# EasyEDA Pro project ProPrj_Xen_2025-02-04.epro, board PCB1_3
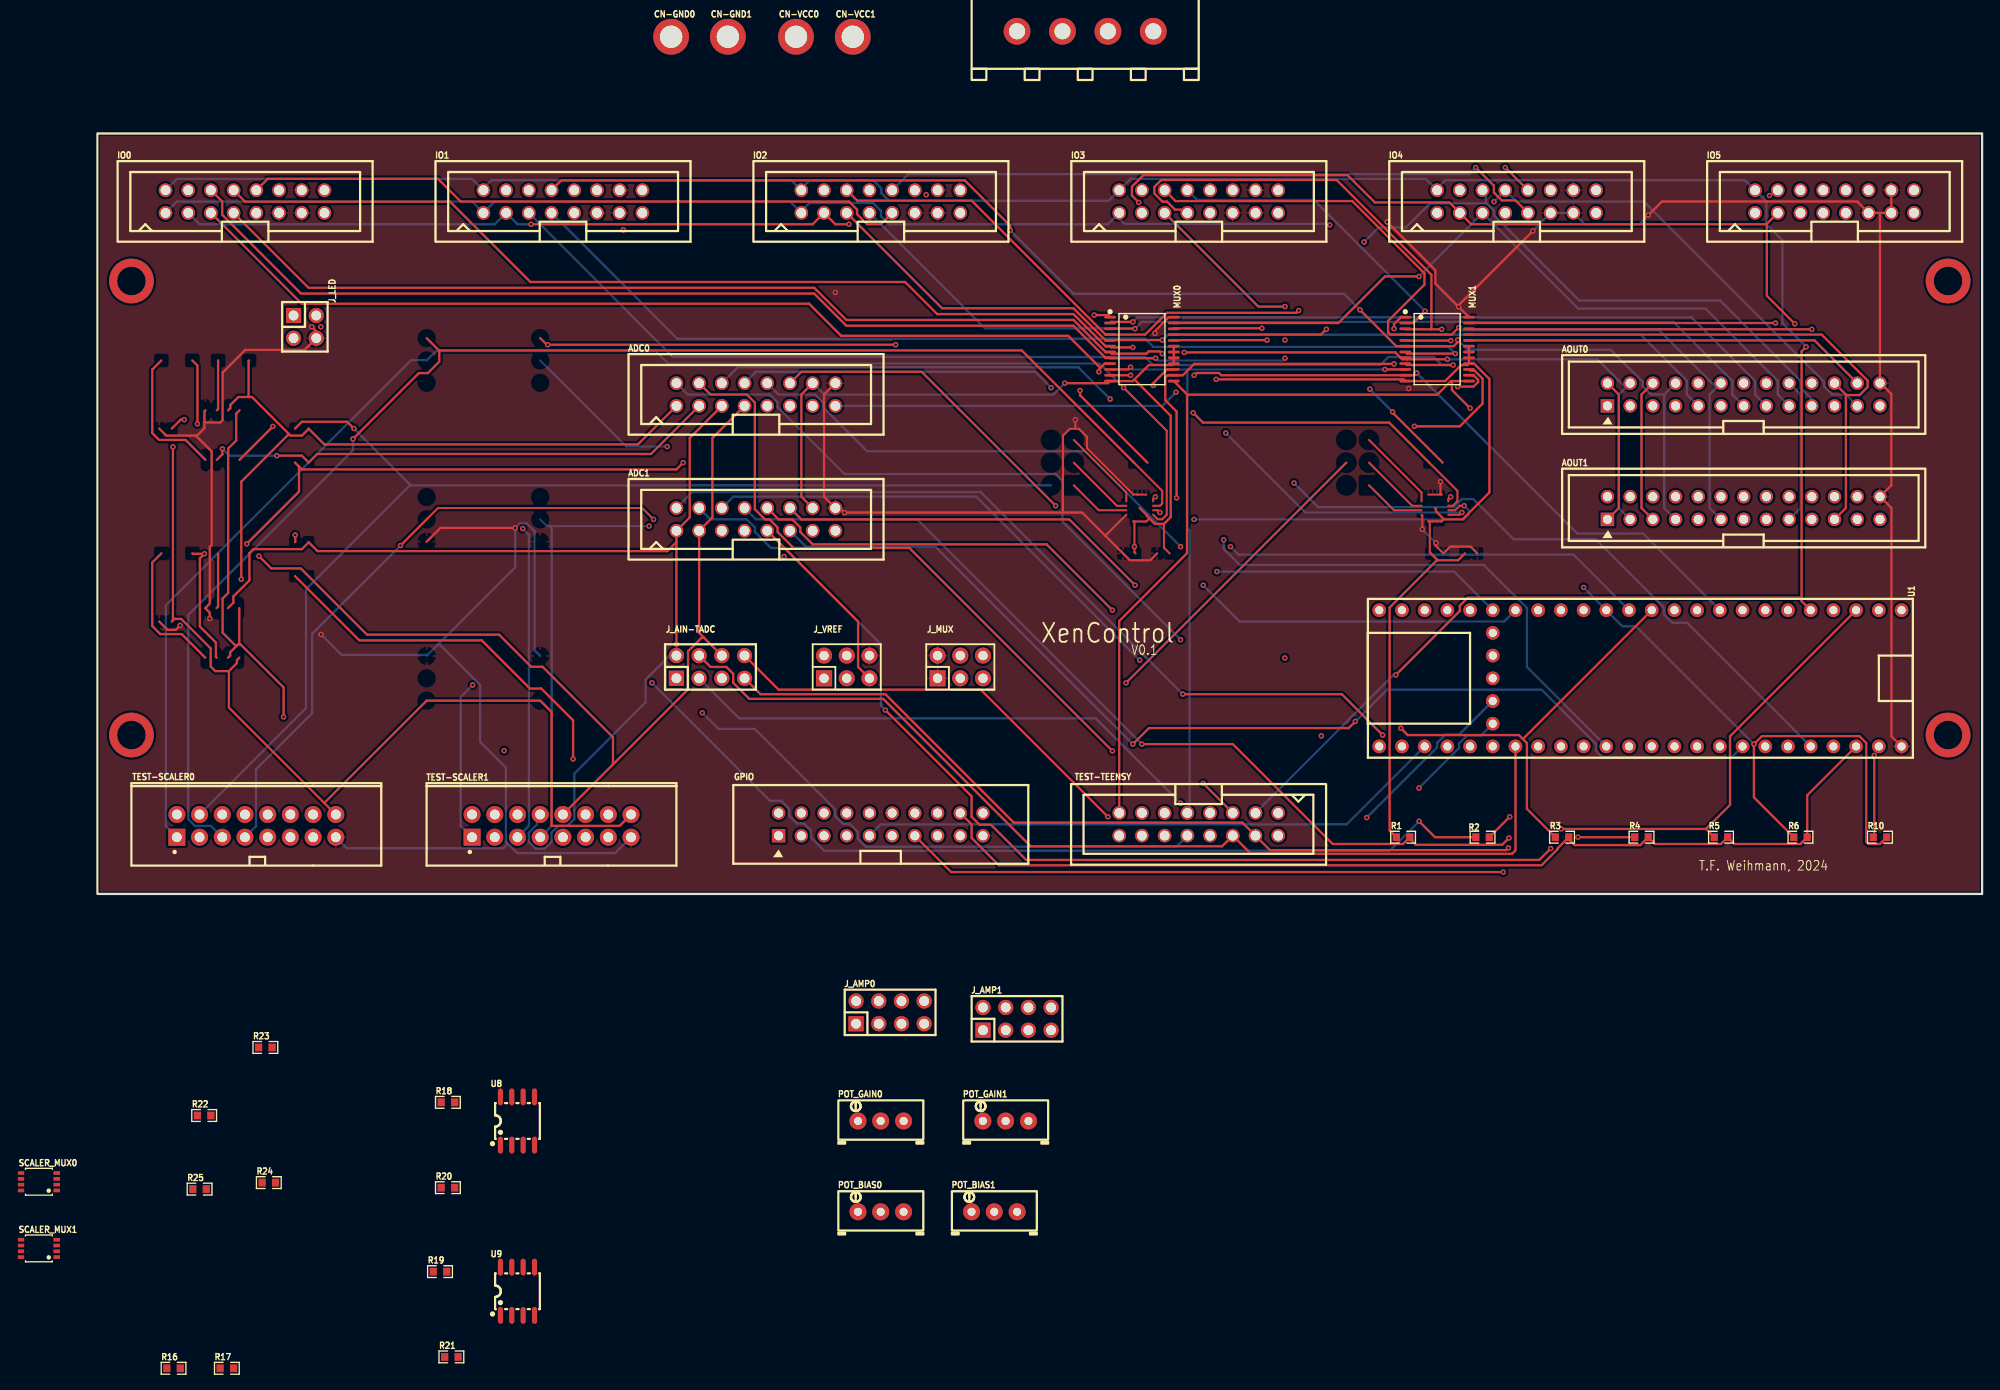
[diagram p28: board, top side]
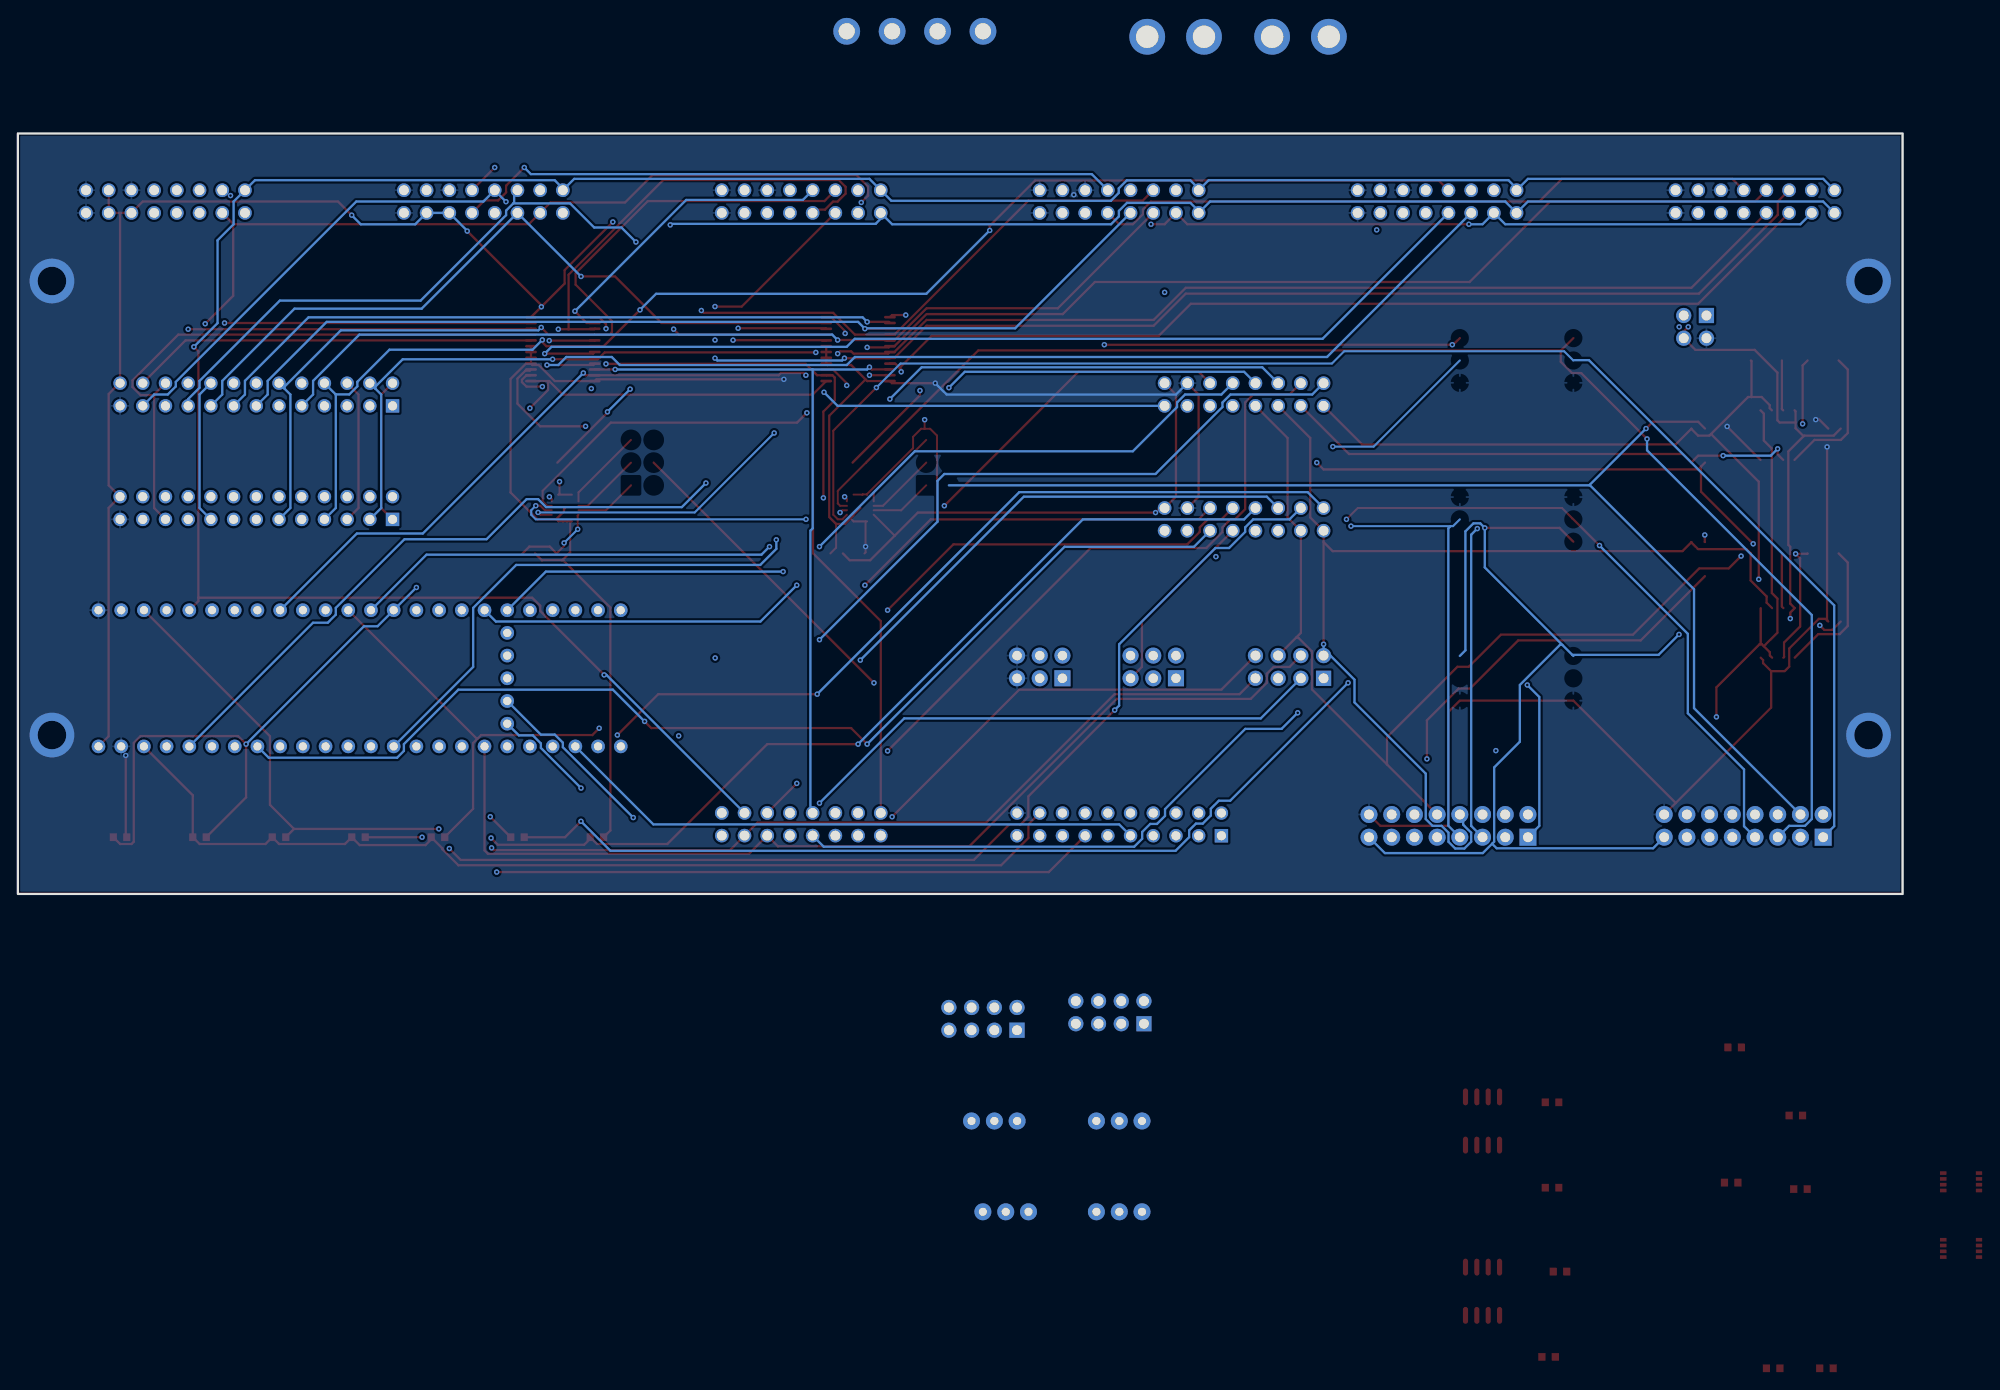
[diagram p29: board, bottom side, seen from below]

Outline 210.82 x 85.09 mm; copper layers: Top Layer, Inner1, Inner2, Bottom Layer. Coordinates in mm from the lower left corner of the outline.
Outline path: rectangle 0,85.09 210.82,0
Stack: Top Layer 0.035mm Outer layer copper thickness 1oz / Dielectric1 0.2104mm 7628 RC49% 8.6mil / Inner1 0.0152mm Inner layer copper thickness / Dielectric2 1.065mm 1.1mm H/HOZ Copper / Inner2 0.0152mm Inner layer copper thickness / Dielectric3 0.2104mm 7628 RC49% 8.6mil / Bottom Layer 0.035mm Outer layer copper thickness 1oz

## Design rules (mm)
template: Custom Config
spacing copperThickness1oz (default): track to track 0.102, other pairs 0.152 to 0.3
spacing copperThickness2oz: track to track 0.203, other pairs 0.152 to 0.3
track width Default (default): min 0.127, default 0.254, max 2.54
track width Analog: min 0.127, default 0.254, max 2.54
track width Power: min 0.127, default 0.254, max 2.54
differential pair differentialPair (default): width min 0.127, default 0.254, max 2.54; gap min 0.152, default 0.152
via viaSize (default): diameter min 0.5, default 0.61, max 10; hole min 0.3, default 0.305, max 6.299
net MUX_OUT0 uses Analog
net GND uses Power
net MUX_OUT1 uses Analog
net +5V uses Power
net AM23 uses Analog
net AM11 uses Analog
net AM22 uses Analog
net AM10 uses Analog
net AM21 uses Analog
net AM9 uses Analog
net AM20 uses Analog
net AM8 uses Analog
net AM19 uses Analog
net AM7 uses Analog
net AM18 uses Analog
net AM6 uses Analog
net AM17 uses Analog
net AM5 uses Analog
net AM16 uses Analog
net AM4 uses Analog
net AM15 uses Analog
net AM3 uses Analog
net AM14 uses Analog
net AM2 uses Analog
net AM13 uses Analog
net AM1 uses Analog
net AM12 uses Analog
net AM0 uses Analog
net OFFSET_OUT0+ uses Analog
net OFFSET_OUT0- uses Analog
net OFFSET_OUT1+ uses Analog
net OFFSET_OUT1- uses Analog

## Placement (name value [footprint] x y rotation side)
ADC0  2.54-2*8P简牛  [IDC-TH_16P-P2.54_C3406]  73.66 55.88 0 top
ADC1  2.54-2*8P简牛  [IDC-TH_16P-P2.54_C3406]  73.66 41.91 0 top
AOUT0  ZX-IDC2.54-2-13PZZ  [IDC-TH_26P-P2.54_ZX-IDC2.54-2-13PZZ]  184.15 55.88 0 top
AOUT1  ZX-IDC2.54-2-13PZZ  [IDC-TH_26P-P2.54_ZX-IDC2.54-2-13PZZ]  184.15 43.18 0 top
CN-GND0  -  [VIA]  64.18 95.91 0 top
CN-GND1  -  [VIA]  70.53 95.91 0 top
CN-PWR  350211-1  [CONN-TH_350211-1]  110.49 96.52 0 top
CN-VCC0  -  [VIA]  78.15 95.91 0 top
CN-VCC1  -  [VIA]  84.5 95.91 0 top
GPIO  ZX-IDC2.54-2-10PZZ  [IDC-TH_20P-P2.54_ZX-IDC2.54-2-10PZZ]  87.63 7.78 0 top
IO0  2.54-2*8P简牛  [IDC-TH_16P-P2.54_C3406]  16.51 77.47 0 top
IO1  2.54-2*8P简牛  [IDC-TH_16P-P2.54_C3406]  52.07 77.47 0 top
IO2  2.54-2*8P简牛  [IDC-TH_16P-P2.54_C3406]  87.63 77.47 0 top
IO3  2.54-2*8P简牛  [IDC-TH_16P-P2.54_C3406]  123.19 77.47 0 top
IO4  2.54-2*8P简牛  [IDC-TH_16P-P2.54_C3406]  158.75 77.47 0 top
IO5  2.54-2*8P简牛  [IDC-TH_16P-P2.54_C3406]  194.31 77.47 0 top
J_AIN-TADC  PZ2.54-2*4  [HDR-TH_8P-P2.54-V-M-R2-C4-S2.54]  68.58 25.4 0 top
J_AMP0  ZX-PZ2.54-2-4PZZ  [HDR-TH_8P-P2.54-V-M-R2-C4-S2.54]  88.67 -13.25 0 top
J_AMP1  ZX-PZ2.54-2-4PZZ  [HDR-TH_8P-P2.54-V-M-R2-C4-S2.54]  102.87 -13.97 0 top
J_LED  PZ254V-12-4P  [HDR-TH_4P-P2.54-V-M-R2-C2-S2.54]  23.21 63.45 270 top
J_MUX  ZX-PZ2.54-2-3PZZ  [HDR-TH_6P-P2.54-V-M-R2-C3-S2.54-1]  96.52 25.4 0 top
J_VREF  ZX-PZ2.54-2-3PZZ  [HDR-TH_6P-P2.54-V-M-R2-C3-S2.54-1]  83.82 25.4 0 top
MUX0  CD74HC4067SM96  [SSOP-24_L8.1-W5.3-P0.65-LS7.8-BL]  116.84 60.96 270 top
MUX1  CD74HC4067SM96  [SSOP-24_L8.1-W5.3-P0.65-LS7.8-BL]  149.86 60.96 270 top
POT_BIAS0  100kΩ  [RES-ADJ-TH_3P-L9.5-W4.9-P2.50-L_3296W]  87.63 -35.56 0 top
POT_BIAS1  100kΩ  [RES-ADJ-TH_3P-L9.5-W4.9-P2.50-L_3296W]  100.33 -35.56 0 top
POT_GAIN0  100kΩ  [RES-ADJ-TH_3P-L9.5-W4.9-P2.50-L_3296W]  87.63 -25.4 0 top
POT_GAIN1  100kΩ  [RES-ADJ-TH_3P-L9.5-W4.9-P2.50-L_3296W]  101.6 -25.4 0 top
R1  10K  [R0603]  146.05 6.35 0 top
R2  330  [R0603]  154.94 6.35 0 top
R3  10K  [R0603]  163.83 6.35 0 top
R4  10K  [R0603]  172.72 6.35 0 top
R5  10K  [R0603]  181.61 6.35 0 top
R6  10K  [R0603]  190.5 6.35 0 top
R10  10K  [R0603]  199.39 6.35 0 top
R16  100K  [R0603]  8.52 -53.07 0 top
R17  100K  [R0603]  14.48 -53.07 0 top
R18  330  [R0603]  39.21 -23.31 0 top
R19  330  [R0603]  38.33 -42.25 0 top
R20  1K  [R0603]  39.21 -32.86 0 top
R21  1K  [R0603]  39.6 -51.8 0 top
R22  1K  [R0603]  11.94 -24.79 0 top
R23  1K  [R0603]  18.79 -17.17 0 top
R24  1K  [R0603]  19.18 -32.29 0 top
R25  1K  [R0603]  11.43 -33.02 0 top
SCALER_MUX0  SN74LVC2G53DCTR  [MSOP-8_L2.9-W2.8-P0.65-LS4.0-BR]  -6.54 -32.2 0 top
SCALER_MUX1  SN74LVC2G53DCTR  [MSOP-8_L2.9-W2.8-P0.65-LS4.0-BR]  -6.54 -39.66 0 top
TEST-SCALER0  IDC16  [CONN-TH_16P-P2.54_TE_1761681-6]  17.78 7.62 0 top
TEST-SCALER1  IDC16  [CONN-TH_16P-P2.54_TE_1761681-6]  50.8 7.62 0 top
TEST-TEENSY  2.54-2*8P简牛  [IDC-TH_16P-P2.54_C3406]  123.19 7.8 180 top
U1  -  [TEENSY 4.1]  171.45 24.13 270 top
U8  MAX4477ASA+T  [SO-8_L4.9-W3.9-P1.27-LS5.9-BL]  46.99 -25.4 0 top
U9  MAX4477ASA+T  [SO-8_L4.9-W3.9-P1.27-LS5.9-BL]  46.99 -44.45 0 top

## Footprints (pads in the part's own frame, mm; a bottom-side part is the same pattern mirrored in y, then rotated)
CONN-TH_16P-P2.54_TE_1761681-6
  rect 1.9x1.9 hole 1.1: 1(-8.89,-1.27)
  round 1.9 hole 1.1: 2(-8.89,1.27) 3(-6.35,-1.27) 4(-6.35,1.269) 5(-3.81,-1.27) 6(-3.81,1.269) 7(-1.27,-1.27) 8(-1.27,1.269) 9(1.27,-1.27) 10(1.27,1.269) 11(3.81,-1.27) 12(3.81,1.269) 13(6.35,-1.27) 14(6.35,1.269) 15(8.89,-1.27) 16(8.89,1.269)
CONN-TH_350211-1
  round 3 hole 1.8: 1(-7.62,0) 2(-2.54,0) 3(2.54,0) 4(7.62,0)
HDR-TH_4P-P2.54-V-M-R2-C2-S2.54
  rect 1.7x1.7 hole 1.1: 1(-1.27,-1.27)
  round 1.7 hole 1.1: 2(-1.27,1.27) 3(1.27,-1.27) 4(1.27,1.27)
HDR-TH_6P-P2.54-V-M-R2-C3-S2.54-1
  rect 1.8x1.8 hole 1.05: 1(-2.54,-1.27)
  round 1.8 hole 1.05: 2(-2.54,1.27) 3(0,-1.27) 4(0,1.27) 5(2.54,-1.27) 6(2.54,1.27)
HDR-TH_8P-P2.54-V-M-R2-C4-S2.54
  rect 1.7x1.7 hole 1.1: 1(-3.81,-1.27)
  round 1.7 hole 1.1: 2(-3.81,1.27) 3(-1.27,-1.27) 4(-1.27,1.27) 5(1.27,-1.27) 6(1.27,1.27) 7(3.81,-1.27) 8(3.81,1.27)
IDC-TH_16P-P2.54_C3406
  round 1.524 hole 1.1: 1(-8.89,-1.27) 2(-8.89,1.27) 3(-6.35,-1.27) 4(-6.35,1.27) 5(-3.81,-1.27) 6(-3.81,1.27) 7(-1.27,-1.27) 8(-1.27,1.27) 9(1.27,-1.27) 10(1.27,1.27) 11(3.81,-1.27) 12(3.81,1.27) 13(6.35,-1.27) 14(6.35,1.27) 15(8.89,-1.27) 16(8.89,1.27)
IDC-TH_20P-P2.54_ZX-IDC2.54-2-10PZZ
  rect 1.5x1.5 hole 1.02: 1(-11.43,-1.27)
  round 1.5 hole 1.02: 2(-11.43,1.27) 3(-8.89,-1.27) 4(-8.89,1.27) 5(-6.35,-1.27) 6(-6.35,1.27) 7(-3.81,-1.27) 8(-3.81,1.27) 9(-1.27,-1.27) 10(-1.27,1.27) 11(1.27,-1.27) 12(1.27,1.27) 13(3.81,-1.27) 14(3.81,1.27) 15(6.35,-1.27) 16(6.35,1.27) 17(8.89,-1.27) 18(8.89,1.27) 19(11.43,-1.27) 20(11.43,1.27)
IDC-TH_26P-P2.54_ZX-IDC2.54-2-13PZZ
  rect 1.5x1.5 hole 1.02: 1(-15.24,-1.27)
  round 1.5 hole 1.02: 2(-15.24,1.27) 3(-12.7,-1.27) 4(-12.7,1.27) 5(-10.16,-1.27) 6(-10.16,1.27) 7(-7.62,-1.27) 8(-7.62,1.27) 9(-5.08,-1.27) 10(-5.08,1.27) 11(-2.54,-1.27) 12(-2.54,1.27) 13(0,-1.27) 14(0,1.27) 15(2.54,-1.27) 16(2.54,1.27) 17(5.08,-1.27) 18(5.08,1.27) 19(7.62,-1.27) 20(7.62,1.27) 21(10.16,-1.27) 22(10.16,1.27) 23(12.7,-1.27) 24(12.7,1.27) 25(15.24,-1.27) 26(15.24,1.27)
MSOP-8_L2.9-W2.8-P0.65-LS4.0-BR
  rect 0.73x0.4 smd: 1(2,-0.975) 2(2,-0.325) 3(2,0.325) 4(2,0.975)
  rect 0.7x0.4 smd: 5(-2,0.976) 6(-2,0.325) 7(-2,-0.325) 8(-2,-0.976)
R0603
  rect 0.806x0.864 smd: 1(-0.753,0) 2(0.753,0)
RES-ADJ-TH_3P-L9.5-W4.9-P2.50-L_3296W
  round 1.9 hole 0.9: 1(-2.55,0) 2(-0.01,0) 3(2.55,0)
SO-8_L4.9-W3.9-P1.27-LS5.9-BL
  oval 0.574x1.888 smd: 1(-1.905,-2.699) 2(-0.635,-2.699) 3(0.635,-2.699) 4(1.905,-2.699) 5(1.905,2.699) 6(0.635,2.699) 7(-0.635,2.699) 8(-1.905,2.699)
SSOP-24_L8.1-W5.3-P0.65-LS7.8-BL
  oval 0.308x1.324 smd: 1(-3.575,-3.562) 2(-2.925,-3.562) 3(-2.275,-3.562) 4(-1.625,-3.562) 5(-0.975,-3.562) 6(-0.325,-3.562) 7(0.325,-3.562) 8(0.975,-3.562) 9(1.625,-3.562) 10(2.275,-3.562) 11(2.925,-3.562) 12(3.575,-3.562) 13(3.575,3.562) 14(2.925,3.562) 15(2.275,3.562) 16(1.625,3.562) 17(0.975,3.562) 18(0.325,3.562) 19(-0.325,3.562) 20(-0.975,3.562) 21(-1.625,3.562) 22(-2.275,3.562) 23(-2.925,3.562) 24(-3.575,3.562)
TEENSY 4.1
  round 1.524 hole 0.914: 1(-7.62,30.353) 2(-7.62,27.813) 3(-7.62,25.273) 4(-7.62,22.733) 5(-7.62,20.193) 6(-7.62,17.653) 7(-7.62,15.113) 8(-7.62,12.573) 9(-7.62,10.033) 10(-7.62,7.493) 11(-7.62,4.953) 12(-7.62,2.413) 13(-7.62,-0.127) 14(-7.62,-2.667) 15(-7.62,-5.207) 16(-7.62,-7.747) 17(-7.62,-10.287) 18(-7.62,-12.827) 19(-7.62,-15.367) 20(-7.62,-17.907) 21(-7.62,-20.447) 22(-7.62,-22.987) 23(-7.62,-25.527) 24(-7.62,-28.067) 25(7.62,30.353) 26(7.62,27.813) 27(7.62,25.273) 28(7.62,22.733) 29(7.62,20.193) 30(7.62,17.653) 31(7.62,15.113) 32(7.62,12.573) 33(7.62,10.033) 34(7.62,7.493) 35(7.62,4.953) 36(7.62,2.413) 37(7.62,-0.127) 38(7.62,-2.667) 39(7.62,-5.207) 40(7.62,-7.747) 41(7.62,-10.287) 42(7.62,-12.827) 43(7.62,-15.367) 44(7.62,-17.907) 45(7.62,-20.447) 46(7.62,-22.987) 47(7.62,-25.527) 48(7.62,-28.067) 49(5.08,-15.367) 50(2.54,-15.367) 51(0,-15.367) 52(-2.54,-15.367) 53(-5.08,-15.367)
VIA
  round 4 hole 2.5: 1(0,0)

## Nets
As in the schematic, except:
TADC0+: J_AIN-TADC.7 TEST-TEENSY.4 U1.35
TADC0-: J_AIN-TADC.3 TEST-TEENSY.2 U1.41
TADC1+: J_AIN-TADC.8 TEST-TEENSY.8 U1.40
TADC1-: J_AIN-TADC.4 TEST-TEENSY.6 U1.42

Pads without a net: IO5 10; TEST-SCALER0 5 7 9 11 13; TEST-SCALER1 5 7 9 11 13; U1 15 39 51 52 53

## Via types
v1: diameter 0.61, hole 0.305, Top Layer to Bottom Layer, 158 vias
v2: diameter 5, hole 3.2, Top Layer to Bottom Layer, 4 vias

## Routing (per net, layer and track width the routed paths; a pad name or vN(x,y) marks a point on that pad's centre or on a via; arc(x,y) is an arc through that point)
+3.3V: length 210.7
  Top Layer w0.254: GPIO.18 97.79,7.78 97.79,6.26 100.84,3.21 161.54,3.21 163.34,5.01 163.34,5.11 164.46,6.23 ; 164.46,6.23 165.22,5.47 172.59,5.47 R4.2 174.24,5.59 181.6,5.59 R5.2 183.13,5.59 190.49,5.59 R6.2 191.25,11.04 U1.27 ; 164.46,6.23 R3.2
  Inner1 w0.254: TEST-SCALER0.14 25.4,10.16 55.88,10.16 TEST-SCALER1.14 70.49,22.23 81.66,22.23 82.56,23.13 82.56,25.41 81.29,26.68 ; 81.29,26.68 82.46,27.85 84.33,27.85 85.09,27.09 85.09,20.48 GPIO.18 ; 81.29,26.68 J_VREF.2
+5V: length 672
  Top Layer w0.225: 109.39,52.05 108.78,52.05 108.01,51.28 108.01,42.67 ; 109.39,52.05 109.79,52.05 110.69,51.15 110.69,49.88 115.84,44.73 115.84,44.71 ; 109.39,52.05 v1(109.39,53.06) ; v1(118.28,62.71) 118.28,62.97 119.85,64.54 MUX0.24 ; v1(150.23,46.13) 150.23,44.81 150.36,44.68 148.86,44.68 ; 115.84,44.71 116.31,44.71 116.34,44.68 117.34,44.68 ; 115.84,44.71 115.84,44.68 ; 115.09,42.43 112.76,40.1 112.76,40.07 ; v1(148.2,40.8) 148.2,42.34 148.11,42.43 ; 150.56,38.1 149.72,38.94 v1(149.72,39.28)
  Top Layer w0.254: 6.92,52.07 7.7,51.29 11.01,51.29 11.08,51.21 ; 154.37,38.1 153.61,38.86 151.32,38.86 150.56,38.1 ; 12.09,54.11 11.98,54 11.98,52.75 ; 199.39,57.21 AOUT0.26 ; 199.39,57.21 200.66,55.94 200.66,45.72 199.4,44.46 ; 199.39,57.21 199.39,76.2 ; ADC0.16 81.28,55.88 81.28,44.45 ADC1.16 83.06,43.18 v1(83.57,42.67) 110.15,42.67 112.76,40.07 115.49,37.34 117.77,37.34 118.53,38.1 ; 11.08,51.21 12.78,49.51 12.78,39.05 12.57,38.84 12.57,32.49 12.07,31.98 12.56,31.48 v1(12.56,30.81) ; 11.08,51.21 11.98,52.11 11.98,52.75 ; v1(23.98,63.45) 24.48,62.94 J_LED.4 23.18,60.88 16.55,60.88 14.01,58.34 14.01,53 13.75,52.75 11.98,52.75 ; 199.4,44.46 200.67,43.19 200.67,17.64 U1.25 ; 199.4,44.46 AOUT1.26 ; 199.39,76.2 IO5.13 IO5.14 ; 199.39,76.2 IO5.11 196.85,77.47 175.01,77.47 v1(173.48,75.95) ; 152.17,65.78 v1(160.56,74.16) ; 152.17,65.78 v1(152.26,65.69) MUX1.24 ; 152.17,65.78 149.66,68.3 149.66,69.8 v1(144.27,75.18) ; v1(46.74,40.96) 38.38,40.96 36.83,39.41 ; v1(9.26,30.05) 8.75,29.54 7.86,29.54 6.92,30.48
  Inner1 w0.225: v1(150.23,46.13) 146.68,49.69 v1(146.68,56.55) ; v1(109.39,53.06) 109.39,53.82 v1(118.28,62.71)
  Inner1 w0.254: IO0.14 22.58,78.46 22.58,76.16 ; IO0.11 20.36,76.16 22.58,76.16 ; v1(46.74,40.96) 46.74,40.7 47.24,40.2 47.75,40.2 48.26,40.7 ; 58.17,75.95 56.13,75.95 IO1.11 ; 58.17,75.95 IO1.13 IO1.14 ; 58.17,75.95 58.17,73.91 64.77,67.31 ; v1(83.57,42.67) 84.46,41.77 84.46,28.57 J_VREF.6 J_MUX.2 J_MUX.1 97.57,20.54 97.57,8 GPIO.19 ; 22.58,76.16 22.9,76.16 ; 64.77,67.31 v1(82.55,67.31) ; 64.77,67.31 48.26,50.8 48.26,40.7 ; v1(12.56,30.81) 10.02,30.81 v1(9.26,30.05) ; 48.26,40.7 48.26,40.68 49.53,39.41 ; 22.9,76.16 23.21,75.85 23.21,64.21 v1(23.98,63.45) ; 22.9,76.16 IO0.13
  Inner2 w0.225: v1(148.2,40.8) 150.23,42.83 v1(150.23,46.13) ; v1(152.26,65.69) 152.01,65.69 149.32,63 149.32,59.19 v1(146.68,56.55)
  Inner2 w0.254: v1(25.01,29.03) 14.34,29.03 v1(12.56,30.81) ; IO3.13 IO3.14 ; IO3.13 IO3.11 126.37,75.57 126.37,70.8 v1(118.28,62.71) ; IO3.13 130.81,74.93 133.35,74.93 134.11,75.69 143.76,75.69 v1(144.27,75.18) ; ADC0.16 v1(82.55,67.31) IO2.11 IO2.13 IO2.14 ; IO4.14 IO4.11 160.56,74.2 v1(160.56,74.16)
  Bottom Layer w0.225: v1(148.2,40.8) v1(149.72,39.28)
  Bottom Layer w0.254: 49.53,26.63 48.9,27.26 48.9,40.57 48.01,41.47 47.24,41.47 v1(46.74,40.96) 46.74,36.54 38.07,27.87 ; TEST-SCALER1.15 57.91,4.57 46.96,4.57 45.91,5.62 ; 38.07,27.87 38.32,27.87 42.81,23.38 42.81,17.03 45.69,14.15 45.69,5.84 45.91,5.62 ; 38.07,27.87 36.95,26.75 ; 36.95,26.75 27.3,26.75 v1(25.01,29.03) ; 36.95,26.75 36.83,26.63 ; v1(173.48,75.95) 172.47,74.93 166.37,74.93 IO4.13 IO4.11 160.56,74.2 v1(160.56,74.16) ; TEST-SCALER0.15 27.91,5.11 45.41,5.11 45.91,5.62
GND: length 741.5
  Top Layer w0.225: 149.87,41.7 149.37,41.7 ; 149.87,41.7 149.86,41.68 ; 149.87,41.7 150.37,41.7 ; 149.37,41.7 149.04,41.7 ; 149.37,41.7 149.36,41.68 ; 117.7,41.99 117.64,41.99 117.34,41.68 116,41.68 ; 149.04,41.7 148.87,41.7 148.86,41.68 ; 149.04,41.7 149.04,38.22 149.16,38.1 ; 150.37,41.7 150.36,41.68 ; 150.37,41.7 150.58,41.96 ; 116,41.68 115.84,41.68 ; 116,41.68 v1(116,38.87) 116,38.22 116.12,38.1 ; 119.3,41.4 119.3,38.74 119.93,38.1
  Top Layer w0.254: 149.88,37.38 149.92,37.34 152.21,37.34 152.97,38.1 ; 149.88,37.38 149.16,38.1 ; 149.88,37.38 144.54,32.05 144.54,7.1 R1.1 ; v1(9.72,53.07) 9.32,53.07 8.32,52.07 ; TEST-SCALER1.16 58.42,7.62 50.84,7.62 50.8,7.66 50.8,20.36 49.53,21.63 36.83,21.63 25.4,10.2 25.4,10.16 ; 116.59,43.18 117.39,42.39 117.39,42.3 117.7,41.99 118.28,41.4 119.3,41.4 120.06,42.16 120.06,53.5 116,57.56 ; 116,57.56 115.82,57.39 MUX0.12 113.04,57.15 v1(108.2,57.15) ; 116,57.56 117.61,59.18 120.25,59.18 MUX0.16 MUX0.17 MUX0.18 MUX0.19 ; 8.45,30.61 8.32,30.48 ; 8.45,30.61 8.62,30.78 9.38,30.78 12.68,27.47 12.68,25.44 13.19,24.93 14.71,24.93 ; 8.45,30.61 v1(8.45,50.02) ; 14.71,24.93 14.71,20.85 25.4,10.16 ; 14.71,24.93 15.61,25.83 15.61,26.17 15.88,26.44 ; R10.1 198.75,6.47 v1(198.75,15.49) ; ADC0.14 78.74,55.88 78.74,44.45 ADC1.14 ; 25.4,10.16 TEST-SCALER0.16 ; MUX1.19 MUX1.18 MUX1.17 153.42,59.4 ; 153.42,59.4 153.93,59.4 155.71,57.62 155.71,44.92 152.7,41.91 150.63,41.91 150.58,41.96 149.73,42.81 149.73,43.06 149.61,43.18 ; 153.42,59.4 MUX1.16 153.27,59.18 152.56,59.18 150.76,57.39 MUX1.12 146.11,57.58 v1(125.14,57.58) ; 15.9,48.57 19.63,52.3 v1(19.63,52.31)
  Inner1 w0.254: v1(116,38.87) 111.26,38.87 99.09,26.7 ; 95.25,77.47 IO2.15 ; 95.25,77.47 IO2.16 ; 95.25,77.47 93.47,77.47 v1(92.71,78.23) ; 99.09,26.7 99.09,24.16 J_MUX.5 GPIO.20 ; 99.09,26.7 J_MUX.6 ; v1(9.72,53.07) 10.48,53.83 18.1,53.83 v1(19.63,52.31)
  Inner2 w0.254: 49.53,57.19 64.73,72.39 64.73,72.43 ; 49.53,57.19 36.83,57.19 ; 49.53,57.19 49.53,44.41 ; IO0.16 25.48,78.66 25.48,78.15 ; v1(198.75,15.49) 199.26,16 U1.26 201.8,19.05 U1.1 199.4,34.15 199.4,41.92 ; v1(108.2,57.15) 109.73,55.63 110.24,55.63 111.13,56.52 111.13,58.56 114.73,62.15 115.23,62.15 ; 115.23,62.15 115.23,60.88 117.03,59.08 123.63,59.08 v1(125.14,57.58) ; 115.23,62.15 116,62.15 125.73,71.88 125.73,77.47 IO3.12 128.27,80.01 130.81,80.01 IO3.16 132.08,78.68 ; IO1.12 57.09,77.53 60.71,77.53 60.96,77.79 ; v1(92.71,78.23) 92.2,78.74 IO2.12 90.17,77.47 90.17,75.95 80.01,65.79 ; 36.83,57.19 26.94,57.19 25.72,58.4 ; 36.83,57.19 36.83,44.41 ; 199.4,41.92 200.66,43.18 200.66,53.34 AOUT0.25 203.2,58.42 IO5.15 IO5.16 202.1,79.84 199.05,79.84 198.04,78.82 ; 199.4,41.92 AOUT1.25 ; 25.48,78.15 25.48,76.12 ; 25.48,78.15 24.97,77.64 21.42,77.64 IO0.12 ; 132.08,78.68 IO3.15 ; 132.08,78.68 133.35,79.95 161.35,79.95 162.48,78.82 ; 60.96,77.79 IO1.16 ; 60.96,77.79 IO1.15 64.73,72.43 ; 25.72,58.4 23.97,60.15 ; 25.72,58.4 v1(19.63,52.31) ; 23.97,60.15 24.23,60.15 25.75,61.68 25.75,75.85 25.48,76.12 ; 23.97,60.15 J_LED.3 ; 198.04,78.82 196.91,79.95 168.91,79.95 167.64,78.68 ; 198.04,78.82 IO5.12 ; 80.01,65.79 71.37,65.79 64.73,72.43 ; 80.01,65.79 ADC0.14 ; v1(8.45,50.02) 9.72,51.29 v1(9.72,53.07) ; 167.64,78.68 IO4.16 166.54,79.84 163.49,79.84 162.48,78.82 ; 167.64,78.68 IO4.15 ; 25.48,76.12 IO0.15 ; 162.48,78.82 IO4.12
  Bottom Layer w0.254: v1(108.2,57.15) 106.93,55.88 81.28,55.88 ADC0.14
  vias: v2(3.81,68.58) v2(3.81,17.78) v2(207.01,68.58) v2(207.01,17.78)
(no net): length 603.6
  Top Layer w0.225: 118.09,43.43 118.85,43.43 119.11,43.69 119.11,45.1 115.96,48.24 ; 36.95,42.03 38.11,43.19 60.94,43.19 v1(62.21,41.92) ; v1(152.89,43.44) 152.38,43.44 151.87,42.93 151.11,42.93 ; 148.98,48.24 152.13,45.1 152.13,43.94 151.62,43.43 151.11,43.43 ; v1(118.85,42.68) 118.6,42.93 118.09,42.93
  Top Layer w0.254: 38.24,60.82 38.2,60.82 36.83,62.19 ; 38.24,60.82 103.39,60.82 115.96,48.24 ; 38.24,60.82 38.24,59.55 36.97,58.28 35.95,58.28 v1(28.59,50.91) ; v1(33.9,38.98) 36.95,42.03 ; v1(89.29,61.45) 50.27,61.45 49.53,62.19 ; v1(122.57,53.83) 123.67,52.74 144.49,52.74 148.98,48.24
  Inner1 w0.254: v1(47.57,40.88) 47.57,53.07 50.62,56.12 50.62,61.2 v1(50.37,61.45)
  Inner2 w0.225: v1(61.7,41.15) 63.4,39.45 120.2,39.45 v1(122.66,41.92) ; v1(62.21,41.92) 118.09,41.92 v1(118.85,42.68)
  Inner2 w0.254: v1(122.57,53.83) 110.63,53.83 107.04,57.43 93.32,57.43 v1(89.29,61.45)
  Bottom Layer w0.225: v1(61.7,41.15) 50.29,41.15 49.53,41.91 ; v1(152.89,43.44) 153.4,42.93 153.4,42.42 152.89,41.92 v1(122.66,41.92)
  Bottom Layer w0.254: 50.56,41.15 50.82,40.9 50.82,7.64 TEST-SCALER1.7 ; TEST-SCALER0.7 17.74,7.58 17.74,13.93 24.03,20.22 24.03,29.11 v1(33.9,38.98) ; v1(47.57,40.88) 48.26,40.19 48.26,7.62 TEST-SCALER1.5 ; v1(28.59,50.91) 28.59,49.64 10.16,31.21 10.16,8.38 10.92,7.62 12.7,7.62 TEST-SCALER0.5
#CS0: length 150.9
  Top Layer w0.254: U1.12 159.49,17.38 159.41,17.38 ; 159.41,17.38 159.9,16.88 159.9,9.52 R3.1 ; 159.41,17.38 159,17.78 146.56,17.78 v1(145.8,18.54) ; v1(113.54,16) 90.83,38.71 77.88,38.71 76.08,40.5 76.08,41.01 75.18,41.91 74.68,41.91 73.54,43.04 73.54,54.98 72.64,55.88 68.58,55.88 ADC0.4
  Inner2 w0.254: v1(145.8,18.54) 136.4,18.54 133.86,16 v1(113.54,16)
#CS1: length 174.2
  Top Layer w0.254: v1(88.14,20.57) 97.79,10.92 97.79,8.64 98.69,7.74 99.96,7.74 103.89,3.81 161.29,3.81 v1(162.56,5.08) ; v1(165.61,6.35) R4.1
  Inner1 w0.254: v1(162.56,5.08) 164.34,5.08 v1(165.61,6.35) 177.93,6.35 187.81,16.23 187.81,20.29 U1.2
  Bottom Layer w0.254: ADC1.4 68.58,41.91 72.64,41.91 73.54,41.01 73.54,40.5 75.34,38.71 76.86,38.71 87.64,27.93 87.64,21.07 v1(88.14,20.57)
AM0: length 177.1
  Top Layer w0.254: 112.19,58.85 112.68,59.34 MUX0.9 ; 112.19,58.85 108.6,62.45 83.2,62.45 79.61,66.04 22.86,66.04 IO0.5 ; 112.19,58.85 112.01,58.67 v1(112.01,58.42)
  Inner2 w0.254: AOUT1.2 AOUT0.1 168.15,55.37 115.06,55.37 v1(112.01,58.42)
AM1: length 181
  Top Layer w0.254: v1(118.36,59.94) 113.32,59.94 MUX0.8 112.77,59.99 109.18,63.58 83.78,63.58 80.19,67.17 22.78,67.17 13.96,75.99 13.96,77.48 IO0.6
  Inner1 w0.254: AOUT0.3 170.18,53.34 156.43,53.34 149.82,59.94 v1(132.84,59.94)
  Inner2 w0.254: AOUT0.3 AOUT1.4
  Bottom Layer w0.254: v1(132.84,59.94) 132.59,59.69 118.62,59.69 v1(118.36,59.94)
AM2: length 179.7
  Top Layer w0.254: v1(119.13,60.45) 118.87,60.71 117.6,60.71 117.35,60.45 113.46,60.45 MUX0.7 112.77,60.64 109.18,64.23 83.78,64.23 80.19,67.82 23.62,67.82 IO0.7
  Inner1 w0.254: AOUT0.5 172.72,55.88 167.64,55.88 162.31,61.21 133.6,61.21 v1(132.84,61.98)
  Inner2 w0.254: v1(119.13,60.45) 119.63,59.94 130.81,59.94 v1(132.84,61.98) ; AOUT0.5 AOUT1.6
AM3: length 187.8
  Top Layer w0.254: v1(115.82,61.15) 113.41,61.15 MUX0.6 112.77,61.29 109.18,64.88 93.94,64.88 90.35,68.47 48.44,68.47 39.46,77.45 16.53,77.45 IO0.8
  Inner2 w0.254: 176.53,54.55 AOUT1.8 ; 176.53,54.55 AOUT0.7 ; 176.53,54.55 175.26,55.82 146.56,55.82 145.8,56.58 145.8,63.44 145.29,63.94 133.86,63.94 131.16,61.25 115.92,61.25 v1(115.82,61.15)
AM4: length 115.8
  Top Layer w0.254: v1(119.13,61.98) 113.32,61.98 MUX0.5 112.77,61.94 109.18,65.53 94.49,65.53 IO2.5
  Inner2 w0.254: AOUT0.9 AOUT1.10
  Bottom Layer w0.254: AOUT0.9 177.8,55.88 177.8,57.4 172.62,62.59 119.74,62.59 v1(119.13,61.98)
AM5: length 121.8
  Top Layer w0.254: IO2.6 84.99,77.57 97.78,77.57 112.77,62.59 MUX0.4 117.19,62.59 119.63,65.02 134.11,65.02 v1(134.37,65.28)
  Inner1 w0.254: AOUT0.11 180.34,53.34 176.28,53.34 175.38,54.24 175.38,54.75 174.48,55.64 173.97,55.64 172.72,56.9 172.72,57.4 167.54,62.58 137.06,62.58 v1(134.37,65.28)
  Inner2 w0.254: AOUT0.11 AOUT1.12
AM6: length 121.2
  Top Layer w0.254: v1(116.08,63.25) 113.29,63.25 MUX0.3
  Inner2 w0.254: AOUT0.13 AOUT1.14
  Bottom Layer w0.254: 116.12,63.29 v1(116.08,63.25) ; 116.12,63.29 116.84,64.01 176.28,64.01 182.88,57.4 182.88,55.88 AOUT0.13 ; 116.12,63.29 99.27,63.29 IO2.7
AM7: length 125.4
  Top Layer w0.254: v1(115.82,64.01) 113.4,64.01 MUX0.2
  Inner2 w0.254: v1(115.82,64.01) 99.82,80.01 87.63,80.01 IO2.8 ; AOUT0.15 AOUT1.16
  Bottom Layer w0.254: AOUT0.15 185.42,55.88 185.42,57.4 178.31,64.52 116.33,64.52 v1(115.82,64.01)
AM8: length 93.9
  Top Layer w0.254: MUX0.23 138.81,63.89 144.02,69.09 v1(147.83,69.09)
  Inner2 w0.254: AOUT0.17 AOUT1.18
  Bottom Layer w0.254: v1(147.83,69.09) IO4.5 165.65,65.49 179.88,65.49 187.96,57.4 187.96,55.88 AOUT0.17
AM9: length 99.6
  Top Layer w0.254: v1(130.26,63.29) 120.46,63.29 MUX0.22
  Inner2 w0.254: v1(141.69,72.94) 141.18,72.94 133.1,64.86 131.83,64.86 v1(130.26,63.29) ; AOUT0.19 AOUT1.20
  Bottom Layer w0.254: AOUT0.19 191.77,55.37 190.5,56.64 190.5,57.4 181.52,66.38 165.77,66.38 156.21,75.95 156.21,76.45 155.4,77.26 ; 155.4,77.26 155.31,77.35 155.31,78.37 IO4.6 ; 155.4,77.26 149.05,77.26 146.36,74.57 143.31,74.57 v1(141.69,72.94)
AM10: length 99
  Top Layer w0.254: MUX0.21 136.86,62.59 v1(137.47,63.19)
  Inner1 w0.254: v1(137.47,63.19) 148.63,74.35 155.74,74.35 157.54,76.14 ; 157.54,76.14 175.5,58.18 177.02,58.18 177.92,57.29 177.92,56.78 178.82,55.88 193.04,55.88 AOUT0.21 ; 157.54,76.14 IO4.7
  Inner2 w0.254: AOUT0.21 AOUT1.22
AM11: length 103.9
  Top Layer w0.254: v1(130.82,61.96) 120.43,61.96 MUX0.20
  Inner2 w0.254: AOUT0.23 AOUT1.24 ; v1(130.82,61.96) 133.36,64.5 135.65,64.5 148.6,77.46 v1(156.22,77.46)
  Bottom Layer w0.254: 157.49,78.73 v1(156.22,77.46) ; 157.49,78.73 IO4.8 ; 157.49,78.73 158.75,77.47 172.97,77.47 193.16,57.29 193.16,56.78 194.06,55.88 195.58,55.88 AOUT0.23
AM12: length 151
  Top Layer w0.254: MUX1.9 146.45,59.18 v1(151.64,59.18) ; AOUT1.1 170.18,43.18 170.18,55.88 AOUT0.2
  Inner2 w0.254: AOUT0.2 153.67,57.15 v1(151.64,59.18)
  Bottom Layer w0.254: v1(151.64,59.18) 150.37,59.18 149.47,60.08 144.39,60.08 143.49,59.18 118.09,59.18 117.19,60.08 64.38,60.08 IO1.5
AM13: length 148.7
  Top Layer w0.254: v1(151.01,59.82) 146.46,59.82 ; 146.46,59.82 MUX1.8 ; 146.46,59.82 145.95,59.82 145.19,60.59 v1(121.57,60.59)
  Inner1 w0.254: v1(121.57,60.59) 113.49,68.67 64.46,68.67 v1(58.83,74.3)
  Inner2 w0.254: IO1.6 49.51,77.49 51.07,77.49 51.97,76.59 51.97,76.08 53.75,74.3 v1(58.83,74.3)
  Bottom Layer w0.254: 170.82,56.52 170.82,56.78 167.77,59.82 v1(151.01,59.82) ; 170.82,56.52 170.18,55.88 170.18,43.18 AOUT1.3 ; 170.82,56.52 AOUT0.4
AM14: length 153
  Top Layer w0.254: MUX1.7 146.48,60.45 v1(151.89,60.45) ; AOUT0.6 172.72,55.88 172.72,43.18 AOUT1.5
  Inner2 w0.254: v1(151.89,60.45) 153.92,58.42 172.72,58.42 AOUT0.6
  Bottom Layer w0.254: IO1.7 64.89,62.11 117.21,62.11 118.11,61.21 151.13,61.21 v1(151.89,60.45)
AM15: length 152.5
  Top Layer w0.254: v1(141.23,65.35) 145.3,61.29 MUX1.6 151.71,61.29 152.16,61.74 v1(152.16,61.99) ; IO1.8 51.89,79.83 97.04,79.83 102.12,74.75 v1(102.12,74.24)
  Bottom Layer w0.254: 175.27,55.89 173.75,55.89 172.85,56.79 172.85,57.3 169.26,60.89 153.26,60.89 v1(152.16,61.99) ; 175.27,55.89 AOUT0.8 ; 175.27,55.89 175.26,55.88 175.26,43.18 AOUT1.7 ; v1(102.12,74.24) 109.21,67.15 139.44,67.15 v1(141.23,65.35)
AM16: length 88.5
  Top Layer w0.254: IO3.5 129.86,65.72 v1(132.84,65.72) ; v1(151.38,61.91) 146.32,61.91 MUX1.5
  Inner1 w0.254: v1(151.38,61.91) 136.65,61.91 v1(132.84,65.72)
  Inner2 w0.254: 177.8,55.82 177.8,43.18 AOUT1.9 ; 177.8,55.82 177.8,55.88 AOUT0.10 ; 177.8,55.82 176.28,55.82 175.38,56.71 175.38,57.22 173.58,59.02 154.28,59.02 v1(151.38,61.91)
AM17: length 97.5
  Top Layer w0.254: v1(152.28,63.38) 151.49,62.59 MUX1.4 144.63,62.59 144.37,62.84 144.37,64.11 148.44,68.17 148.44,69.44 140.35,77.53 120.59,77.53 IO3.6
  Bottom Layer w0.254: 180.98,56.52 180.98,56.78 174.69,63.06 152.6,63.06 v1(152.28,63.38) ; 180.98,56.52 AOUT0.12 ; 180.98,56.52 180.34,55.88 180.34,43.18 AOUT1.11
AM18: length 103.4
  Top Layer w0.254: MUX1.3 146.35,63.18 149.22,63.18 ; 149.22,63.18 149.22,69.28 138.62,79.88 119,79.88 118.24,79.12 118.24,78.36 119.13,77.46 119.64,77.46 120.54,76.56 121.56,76.56 IO3.7 ; 149.22,63.18 v1(150.37,63.18)
  Inner2 w0.254: 182.88,55.82 182.88,43.18 AOUT1.13 ; 182.88,55.82 181.36,55.82 180.46,56.71 180.46,57.22 175.07,62.61 150.94,62.61 v1(150.37,63.18) ; 182.88,55.82 182.88,55.88 AOUT0.14
AM19: length 93.6
  Top Layer w0.254: MUX1.2 147.2,63.89 v1(148.51,65.2)
  Inner2 w0.254: AOUT0.16 186.11,56.57 ; 186.11,56.57 185.42,55.88 185.42,43.18 AOUT1.15 ; 186.11,56.57 186.11,56.82 176.45,66.47 149.78,66.47 v1(148.51,65.2)
  Bottom Layer w0.254: IO3.8 123.01,77.65 136.07,77.65 v1(148.51,65.2)
AM20: length 71.7
  Top Layer w0.254: v1(187.71,63.88) 153.43,63.88
  Inner2 w0.254: 189.23,63.88 v1(187.71,63.88) ; 189.23,63.88 AOUT0.18 ; 189.23,63.88 189.23,74.93 IO5.5
  Bottom Layer w0.254: AOUT1.17 190.5,43.18 190.5,55.88 AOUT0.18
AM21: length 76.8
  Top Layer w0.254: MUX1.22 153.47,63.18 v1(191.77,63.18)
  Inner2 w0.254: AOUT1.19 193.04,43.18 193.04,55.88 AOUT0.20 v1(191.77,63.18) 191.77,77.47 IO5.6
AM22: length 86.1
  Top Layer w0.254: 195.58,55.82 195.58,55.88 AOUT0.22 ; 195.58,55.82 197.1,55.82 198,56.71 198,57.46 192.88,62.59 MUX1.21 ; 195.58,55.82 195.58,43.18 AOUT1.21
  Inner2 w0.254: IO5.7 194.31,74.93 AOUT0.22
AM23: length 84.9
  Top Layer w0.254: MUX1.20 192.06,61.94 AOUT0.24
  Inner1 w0.254: AOUT1.23 198.12,43.18 198.12,55.88 AOUT0.24
  Inner2 w0.254: IO5.8 194.31,77.47 194.31,75.69 196.85,73.15 AOUT0.24
DRDY0: length 138.5
  Inner2 w0.254: v1(113.28,55.37) 114.05,54.61 145.8,54.61 146.69,53.71 153.43,53.71 174.98,32.16 174.98,30.64 U1.30
  Bottom Layer w0.254: v1(113.28,55.37) 109.73,58.93 71.63,58.93 ADC0.6
DRDY1: length 129.9
  Inner2 w0.254: v1(116.59,26.16) 120.4,26.16 127.25,33.02 164.08,33.02 164.98,32.12 164.98,31.36 165.88,30.46 167.53,30.46 U1.33
  Bottom Layer w0.254: v1(116.59,26.16) 98.3,44.45 71.12,44.45 ADC1.6
IO0: length 76.6
  Inner2 w0.254: U1.24 131.46,19.83 86.98,19.83 GPIO.2
IO1: length 76.6
  Inner2 w0.254: GPIO.4 88.62,18.93 133.1,18.93 U1.23
IO2: length 76.6
  Inner2 w0.254: GPIO.6 90.26,18.03 134.75,18.03 U1.22
IO3: length 76.6
  Inner1 w0.254: v1(136.91,17.69) 136.94,17.69 U1.21
  Inner2 w0.254: GPIO.8 90.11,15.34 134.56,15.34 v1(136.91,17.69)
IO4: length 81
  Inner2 w0.254: GPIO.10 90.85,13.54 142.96,13.54 U1.47 146.82,17.41 146.82,25.03 U1.20
IO5: length 82.8
  Inner2 w0.254: GPIO.12 91.59,11.75 142.65,11.75 147.14,16.24 147.14,16.75 155.96,25.56 156.46,25.56 157.36,26.46 157.36,27.95 U1.17
IO6: length 69
  Inner2 w0.254: U1.43 154.95,17.64 150.58,17.64 149.68,16.75 149.68,16.24 144.29,10.85 93.24,10.85 GPIO.14
IO7: length 71.6
  Inner2 w0.254: GPIO.1 77.47,7.78 84.07,7.78 84.97,8.68 84.97,9.19 90.36,14.58 141.45,14.58 U1.48
IO8: length 102.2
  Inner2 w0.254: U1.16 157.47,25.52 157.47,16.41 145.8,4.74 80.52,4.74 GPIO.3
IO9: length 77.5
  Inner2 w0.254: GPIO.5 82.55,5.24 142.28,5.24 U1.44
IO10: length 71.3
  Inner2 w0.254: GPIO.7 85.09,7.78 142.28,7.78 U1.45
IO11: length 66.2
  Bottom Layer w0.254: GPIO.9 87.63,7.78 139.74,7.78 U1.46
IO12: length 91.3
  Inner1 w0.254: GPIO.11 91.59,3.82 141.12,3.82 147.41,10.11 167.46,10.11 U1.36
LDOUT1: length 74.6
  Top Layer w0.254: IO2.9 87.63,74.93 86.11,74.93 84.97,76.06 84.97,76.57 84.07,77.47 40.64,77.47 38.1,80.01 19.05,80.01 IO0.10
LDOUT2: length 74.7
  Top Layer w0.254: v1(154.18,81.28) 156.21,79.25 156.21,78.49 157.11,77.59 158.63,77.59 IO4.9
  Bottom Layer w0.254: IO2.10 90.7,80.54 153.43,80.54 v1(154.18,81.28)
LDOUT3: length 113.7
  Top Layer w0.254: v1(157.48,81.28) IO4.10
  Inner2 w0.254: v1(157.48,81.28) 156.72,80.52 101.6,80.52 101.09,81.03 54.1,81.03 52.07,78.99 52.07,77.47 IO1.9
LDOUT4: length 74.5
  Inner2 w0.254: IO1.10 55.12,80.52 100.08,80.52 105.46,75.13 123.39,75.13 IO3.9
LDOUT5: length 74.6
  Inner1 w0.254: IO5.9 194.31,77.47 171.2,77.47 168.66,80.01 157.23,80.01 156.09,78.88 156.09,78.37 155.19,77.47 125.73,77.47 IO3.10
LEDS: length 139.2
  Inner1 w0.254: v1(67.66,20.27) 65.78,22.16 64.51,22.16 25.89,60.77 25.89,62.55 v1(24.99,63.45)
  Inner2 w0.254: IO0.9 17.78,71.43 J_LED.2 24.48,63.96 v1(24.99,63.45)
  Bottom Layer w0.254: v1(67.66,20.27) 69.46,18.47 73.52,18.47 82.51,9.49 82.51,8.73 83.4,7.83 84.17,7.83 85.06,6.94 85.06,6.17 85.95,5.28 120.68,5.28 TEST-TEENSY.10
MISO0: length 170
  Top Layer w0.254: R6.1 185.29,10.8 v1(185.29,16.76) 186.19,17.66 197.09,17.66 197.86,16.9 197.86,5.84 198.11,5.59 199.38,5.59 R10.2
  Inner2 w0.254: v1(166.24,34.29) 147.48,53.05 110.27,53.05 v1(106.68,56.64)
  Bottom Layer w0.254: v1(106.68,56.64) 104.9,58.42 73.66,58.42 ADC0.8 ; v1(166.24,34.29) U1.14 170.58,29.95 172.1,29.95 v1(185.29,16.76)
MISO1: length 157.3
  Top Layer w0.254: 146.72,6.26 R1.2 ; 146.72,6.26 146.04,5.59 138.18,5.59 127,16.76 v1(116.84,16.76) ; 146.72,6.26 147.48,5.5 157.13,5.5 v1(157.89,6.26) ; U1.3 182.62,17.65 182.62,9.97 179.93,7.28 ; 179.93,7.28 R5.1 ; 179.93,7.28 v1(163.73,7.28)
  Inner1 w0.254: v1(163.73,7.28) 162.72,6.26 v1(157.89,6.26)
  Bottom Layer w0.254: ADC1.8 73.66,41.91 91.69,41.91 v1(116.84,16.76)
MOSI0: length 107.2
  Inner2 w0.254: v1(121.16,38.86) v1(126.75,38.86)
  Bottom Layer w0.254: v1(121.16,38.86) 110.49,49.53 86.11,49.53 81.16,54.47 81.16,54.98 80.26,55.88 76.2,55.88 ADC0.10 ; U1.13 165.11,37.96 127.64,37.96 v1(126.75,38.86)
MOSI1: length 92.1
  Top Layer w0.254: v1(113.54,31.75) 106.17,39.12 80.01,39.12 78.62,40.5 78.62,41.01 77.72,41.91 76.2,41.91 ADC1.10
  Inner2 w0.254: v1(123.7,34.54) 120.9,31.75 v1(113.54,31.75)
  Bottom Layer w0.254: U1.18 157.35,30.48 127.76,30.48 v1(123.7,34.54)
MUX_EN0: length 44.9
  Top Layer w0.254: v1(118.11,56.9) 118.11,57.15 119.65,58.69 MUX0.15
  Inner1 w0.254: v1(118.11,56.9) 111.26,50.05 111.26,41.41 97.79,27.94 97.79,25.4 J_MUX.3
MUX_EN1: length 74.8
  Top Layer w0.254: MUX1.15 153.55,58.56 154.04,58.56 154.94,57.66 154.94,54.86 152.4,52.32 v1(147.32,52.32)
  Inner2 w0.254: v1(147.32,52.32) 144.53,49.53 139.19,49.53 126.72,37.06 106.91,37.06 J_MUX.4
MUX_OUT0: length 15
  Inner1 w0.254: ADC0.13 81.28,53.34 81.28,41.91 ADC1.15
MUX_OUT1: length 82.6
  Top Layer w0.254: MUX1.1 145.81,64.54 145.03,63.75 v1(145.03,63.25) ; v1(144.87,53.94) 144.87,53.86 150.48,48.26
  Inner2 w0.254: 140.3,58.51 v1(145.03,63.25) ; 140.3,58.51 v1(142.33,56.48) ; 140.3,58.51 137.92,56.13 v1(120.65,56.13)
  Bottom Layer w0.254: v1(142.33,56.48) v1(144.87,53.94) ; ADC0.15 119.13,54.61 v1(120.65,56.13)
OFFSET_OUT0+: length 272.3
  Top Layer w0.254: ADC0.3 61.92,49.22 24.58,49.22 23.63,48.28 ; 13.36,48.57 13.98,49.19 v1(13.98,49.8) ; 22.55,47.81 22.55,45.02 v1(16.71,39.18) ; 22.55,47.81 22.87,47.5 64.77,47.5 v1(65.53,48.26) ; 22.55,47.81 22.11,48.26 ; v1(20.08,49.04) 22.87,49.04 23.63,48.28 ; 23.63,48.28 23.61,48.26 ; 10.62,59.69 11.19,59.13 v1(11.19,52.6)
  Inner1 w0.254: v1(16.71,39.18) 14.92,37.38 14.92,9.84 TEST-SCALER0.6 ; 19.05,8.89 20.08,9.92 v1(20.08,49.04) ; ADC0.3 70.9,51.02 70.9,42.13 ADC1.7 68.58,36.83 68.58,25.4 J_AIN-TADC.5 ; v1(13.98,49.8) v1(11.19,52.6)
  Inner2 w0.254: 106.68,48.26 v1(65.53,48.26)
  Bottom Layer w0.254: v1(20.08,49.04) 14.74,49.04 v1(13.98,49.8)
OFFSET_OUT0-: length 273.9
  Top Layer w0.254: 16.91,55.6 15.77,55.6 14.87,54.7 14.87,54.35 14.63,54.11 ; 16.91,55.6 16.91,59.62 16.98,59.69 ; 16.91,55.6 17.29,55.6 21.43,51.46 ; 23.64,52.04 22.88,51.28 21.61,51.28 21.43,51.46 ; 23.64,52.04 25.39,50.29 60.45,50.29 ADC0.1 ; 23.64,52.04 23.61,52.07 ; 22.11,52.07 22.87,52.83 27.94,52.83 v1(28.7,52.07) ; 21.43,51.46 16.09,46.13 v1(16.09,35.21)
  Inner1 w0.254: J_AIN-TADC.1 66.04,25.4 66.04,36.83 ADC1.5 68.36,42.13 68.36,51.02 ADC0.1 ; v1(16.09,35.21) 16.09,9.3 16.51,8.89
  Bottom Layer w0.254: 35.01,45.77 35.05,45.72 106.68,45.72 ; 35.01,45.77 23.33,34.09 23.33,20.79 TEST-SCALER0.4 ; 35.01,45.77 v1(28.7,52.07)
OFFSET_OUT1+: length 279.9
  Top Layer w0.254: 10.62,38.1 10.67,38.06 v1(11.97,38.06) 11.46,37.55 11.46,29.93 13.26,28.13 13.26,26.51 13.34,26.44 ; 57.67,14.49 57.67,17.54 49.8,25.42 48.53,25.42 44.94,29.01 30.17,29.01 22.76,36.42 19.46,36.42 v1(18.07,37.8) ; 57.67,14.49 66.07,22.89 66.07,27.15 67.59,28.67 67.85,28.67 ; 57.67,14.49 52.07,8.89 ; 67.85,28.67 67.31,29.21 ADC1.3 68.8,42.13 68.8,51.02 ADC0.7 ; 67.85,28.67 J_AIN-TADC.6 ; 139.7,48.26 v1(115.06,23.62) ; v1(53.21,15.11) 53.21,19.43 49.65,22.98 48.38,22.98 43,28.37 29.3,28.37 22.11,35.56
  Inner2 w0.254: TEST-SCALER1.6 v1(53.21,15.11) 59.95,21.84 113.28,21.84 v1(115.06,23.62) ; v1(18.07,37.8) 12.23,37.8 v1(11.97,38.06)
OFFSET_OUT1-: length 270.6
  Top Layer w0.254: 22.11,39.37 22.13,39.4 v1(22.13,40.17) ; ADC0.5 66.26,51.02 66.26,42.13 ADC1.1 64.77,39.37 ; 23.64,39.34 22.88,38.58 17.46,38.58 17.01,38.13 ; 23.64,39.34 24.63,38.35 63.75,38.35 64.77,39.37 ; 23.64,39.34 23.61,39.37 ; 17.01,38.13 16.98,38.1 ; 17.01,38.13 17.01,35.08 15.21,33.29 15.21,32.59 14.61,31.98 ; 64.77,39.37 v1(64.77,27.94)
  Inner1 w0.254: v1(45.5,16.03) 45.5,17.05 37.12,25.43 36.36,25.43 35.46,26.33 35.46,26.84 v1(22.13,40.17)
  Inner2 w0.254: 48.55,12.99 TEST-SCALER1.4 ; 48.55,12.99 57.93,22.37 111.27,22.37 119.35,30.45 121.89,30.45 137.16,45.72 139.7,45.72 ; 48.55,12.99 v1(45.5,16.03)
  Bottom Layer w0.254: 49.53,8.89 49.16,8.52 49.16,7.76 48.26,6.86 48.26,5.84 49.02,5.08 50.04,5.08 50.8,5.84 50.8,6.86 51.56,7.62 52.58,7.62 53.34,8.38 53.34,13.46 61.31,21.44 61.31,23.98 64.01,26.67 J_AIN-TADC.2 v1(64.77,27.94)
ONOFF: length 70.4
  Inner1 w0.254: v1(147.83,11.85) 145.21,9.23 138.09,9.23 133.6,4.74 99.31,4.74 97.67,6.38 97.67,6.89 96.77,7.78 95.25,7.78 GPIO.15
  Bottom Layer w0.254: U1.49 154.78,17.74 153.22,17.74 152.32,16.85 152.32,16.34 v1(147.83,11.85)
PROG: length 68
  Inner1 w0.254: GPIO.17 98.81,4.23 137.67,4.23 v1(141.99,8.55)
  Bottom Layer w0.254: U1.50 152.32,17.83 150.76,17.83 149.86,16.93 149.86,16.42 v1(141.99,8.55)
PWDN0: length 155.4
  Inner2 w0.254: U1.28 192.91,15.24 188.72,15.24 187.85,16.11 187.85,16.87 174.38,30.34 173.62,30.34 172.72,31.24 172.72,32 171.2,33.53 126.24,33.53 v1(121.16,28.45)
  Bottom Layer w0.254: v1(121.16,28.45) 107.95,41.66 107.95,46.23 107.19,46.99 83.57,46.99 76.08,54.47 76.08,54.98 75.18,55.88 66.04,55.88 ADC0.2
PWDN1: length 134.3
  Top Layer w0.254: v1(143.76,17.78) 139.19,22.35 v1(121.41,22.35)
  Inner1 w0.254: U1.31 185.29,17.78 v1(143.76,17.78)
  Bottom Layer w0.254: ADC1.2 66.55,44.96 98.81,44.96 v1(121.41,22.35)
RESET0: length 131.1
  Inner2 w0.254: ADC0.11 79.76,52.32 127.51,52.32 v1(133.86,45.97)
  Bottom Layer w0.254: U1.29 177.81,30.34 176.16,30.34 175.26,31.24 175.26,32 167.58,39.69 158.4,39.69 153.91,44.18 152.64,44.18 151.74,43.28 136.55,43.28 v1(133.86,45.97)
RESET1: length 123.1
  Top Layer w0.254: v1(115.82,16.76) 117.62,18.56 139.97,18.56 v1(140.72,19.3)
  Bottom Layer w0.254: ADC1.11 79.27,38.84 93.74,38.84 v1(115.82,16.76) ; v1(140.72,19.3) 144.27,22.86 161.54,22.86 167.64,16.76 167.64,16 168.4,15.24 182.75,15.24 U1.32
SCALER_IN0: length 146.1
  Top Layer w0.254: v1(109.92,56.32) 109.92,55.8 117.46,48.26 ; 113.28,64.54 113.04,64.77 v1(111.51,64.77)
  Inner2 w0.254: 108.9,62.17 v1(111.51,64.77) ; 108.9,62.17 108.9,57.34 v1(109.92,56.32) ; 108.9,62.17 89.09,62.17 82.8,55.88 81.28,55.88 80.01,54.61 78.74,55.88 63.5,55.88 50.93,43.31 43.31,43.31 TEST-SCALER0.2
SCALER_IN1: length 73.5
  Inner1 w0.254: v1(76.81,37.74) 79.35,40.28 79.35,41.3 ; 79.35,41.3 80.01,40.64 ; 79.35,41.3 78.86,41.79 78.86,54.98 79.76,55.88 81.28,55.88 82.55,54.61
  Inner2 w0.254: TEST-SCALER1.2 44.64,11.62 44.64,16.19 48.23,19.78 53.77,19.78 71.73,37.74 v1(76.81,37.74)
SCALER_INV0: length 123.5
  Top Layer w0.225: v1(118.34,44.44) 118.09,44.19 118.09,43.93
  Inner2 w0.225: TEST-SCALER0.3 12.69,7.61 27.16,7.61 61.04,41.49 61.04,41.75 63.73,44.44 v1(118.34,44.44)
SCALER_INV1: length 123.3
  Top Layer w0.225: 151.11,43.93 151.11,44.19 v1(151.36,44.44)
  Inner1 w0.225: v1(132.82,26.41) 150.86,44.44 v1(151.36,44.44)
  Inner2 w0.225: TEST-SCALER1.3 45.71,7.61 72.12,7.61 85.83,21.33 127.74,21.33 v1(132.82,26.41)
SCLK0: length 113.7
  Top Layer w0.254: ADC0.12 78.74,58.42 92.2,58.42 v1(107.19,43.43)
  Inner2 w0.254: v1(107.19,43.43) 122.17,43.43 v1(125.98,39.62)
  Bottom Layer w0.254: U1.38 159.89,25.4 159.89,32 155.09,36.81 127.78,36.81 125.98,38.61 v1(125.98,39.62)
SCLK1: length 84.6
  Top Layer w0.254: v1(116.08,34.54) 108.71,41.91 78.74,41.91 ADC1.12
  Inner2 w0.254: v1(125.22,36.07) 124.6,35.44 116.98,35.44 v1(116.08,34.54)
  Bottom Layer w0.254: v1(125.22,36.07) 151.77,36.07 U1.19
SELECT0: length 303.4
  Inner1 w0.254: U1.4 195.58,33.15 195.58,66.04 IO5.1 184.91,76.71 169.42,76.71 168.66,77.47 157.23,77.47 156.09,76.34 156.09,75.83 155.19,74.93 151.13,74.93 IO4.1 139.19,76.2 v1(137.85,74.86) 132.08,69.09 TEST-TEENSY.1
  Bottom Layer w0.254: 113.97,75.87 113.03,74.93 88.54,74.93 87.66,75.81 87.66,76.42 86.77,77.32 79.65,77.32 78.64,76.3 ; 113.97,75.87 114.87,74.98 137.73,74.98 v1(137.85,74.86) ; 113.97,75.87 IO3.1 ; 78.64,76.3 IO2.1 ; 78.64,76.3 77.47,77.47 44.45,77.47 IO1.1 41.91,77.47 8.89,77.47 IO0.1
SELECT1: length 305.5
  Top Layer w0.254: v1(191.13,61.21) 190.63,60.71 190.63,33.15 ; 190.63,33.15 153.29,33.15 152.39,32.25 152.39,31.66 v1(145.24,24.51) ; 190.63,33.15 190.63,32.77 U1.5
  Bottom Layer w0.254: 78.65,78.83 IO2.2 ; 78.65,78.83 79.67,79.84 86.78,79.84 87.68,78.94 87.68,78.44 88.56,77.56 113.12,77.56 IO3.2 115.57,80.01 148.59,80.01 149.76,78.84 ; 78.65,78.83 77.62,79.86 44.09,79.86 43.08,78.84 ; v1(145.24,24.51) 144.98,24.51 TEST-TEENSY.3 ; 43.08,78.84 IO1.2 ; 43.08,78.84 41.91,80.01 8.89,80.01 IO0.2 ; 149.76,78.84 150.77,79.86 184.3,79.86 IO5.2 186.69,77.47 186.69,74.93 188.49,73.13 188.49,63.86 v1(191.13,61.21) ; 149.76,78.84 IO4.2
SELECT2: length 305.3
  Top Layer w0.254: v1(123.7,12.37) TEST-TEENSY.5 ; 186.74,74.98 IO5.3 ; 186.74,74.98 186.69,74.93 153.67,74.93 IO4.3 151.23,77.37 142.9,77.37 139.85,80.42 116.99,80.42 115.72,79.15 115.72,78.13 v1(116.48,77.37) ; 186.74,74.98 186.74,66.93 v1(189.87,63.8) ; v1(48.51,74.93) 80.01,74.93 IO2.3 82.55,74.93 v1(84.07,74.93)
  Inner1 w0.254: v1(123.7,12.37) 122.94,13.13 122.94,40.73 123.65,41.45 123.65,66.85 115.57,74.93 ; 115.57,74.93 v1(84.07,74.93) ; 115.57,74.93 116.74,76.1 ; v1(116.48,77.37) 116.74,77.11 116.74,76.1 ; 116.74,76.1 IO3.3
  Inner2 w0.254: U1.6 190.37,33.02 190.37,63.29 v1(189.87,63.8)
  Bottom Layer w0.254: IO0.3 11.43,74.93 44.45,74.93 IO1.3 46.99,74.93 v1(48.51,74.93)
SELECT3: length 303.1
  Inner1 w0.254: 45.62,78.84 46.63,79.86 80.16,79.86 IO2.4 82.55,80.01 115.57,80.01 116.74,78.84 ; 45.62,78.84 IO1.4 ; 45.62,78.84 44.45,80.01 11.43,80.01 IO0.4 ; 187.8,78.9 v1(187.04,78.14) ; 187.8,78.9 IO5.4 ; 187.8,78.9 186.18,80.52 154.18,80.52 IO4.4 151.28,79.86 123.41,79.86 ; 116.74,78.84 117.75,79.86 123.41,79.86 ; 116.74,78.84 IO3.4 ; 123.41,79.86 123.41,74.78 124.3,73.88 124.3,9.22 TEST-TEENSY.7
  Inner2 w0.254: v1(187.04,78.14) 186.78,77.89 186.78,63.92 187.8,62.9 187.8,32.99 U1.7
SELECT4: length 135.7
  Top Layer w0.254: v1(115.56,58.94) 115.31,58.69 MUX0.10 ; v1(144.01,58.69) MUX1.10
  Inner1 w0.254: v1(144.01,58.69) 145.54,57.16 148.08,57.16 165.14,40.1 169.71,40.1 177.79,32.02 177.79,31.25 178.56,30.49 182.76,30.49 U1.8
  Bottom Layer w0.254: 121.91,58.69 v1(144.01,58.69) ; 121.91,58.69 121.91,40.91 122.17,40.65 122.17,9.31 TEST-TEENSY.9 ; 121.91,58.69 115.82,58.69 v1(115.56,58.94)
SELECT5: length 129.8
  Top Layer w0.254: v1(122.68,58.04) 122.93,58.29 125.47,58.29 125.72,58.04 MUX1.11 147.31,58.04 v1(147.57,58.29) ; MUX0.11 v1(115.56,58.04)
  Inner1 w0.254: v1(122.68,58.04) 121.78,57.14 121.78,44.44 119.98,42.64 119.98,9.67 TEST-TEENSY.11
  Inner2 w0.254: v1(115.56,58.04) v1(122.68,58.04)
  Bottom Layer w0.254: v1(147.57,58.29) 165.53,40.33 172.9,40.33 U1.9
SELECT6: length 126.4
  Top Layer w0.254: v1(145.04,59.31) 122.69,59.31 121.42,58.04 MUX0.14 119.7,58.04 119.45,57.78 119.45,55.24 120.72,53.97 v1(120.72,44.32) ; v1(152.15,56.77) 153.93,56.77 154.44,57.27 154.44,57.53 153.93,58.04 MUX1.14
  Inner1 w0.254: U1.10 170.09,40.6 168.32,40.6 v1(152.15,56.77) 149.61,59.31 v1(145.04,59.31) ; v1(120.72,44.32) 119.45,43.05 119.45,11.68 TEST-TEENSY.13
SELECT7: length 120.4
  Top Layer w0.254: MUX0.13 121.88,55.9 ; 121.88,55.9 121.88,38.12 114.3,30.54 TEST-TEENSY.15 ; 121.88,55.9 121.93,55.86 149.87,55.86 151.39,57.39 151.52,57.39 ; 151.52,57.39 MUX1.13 ; 151.52,57.39 151.52,56.38 v1(153.55,54.35)
  Inner2 w0.254: v1(153.55,54.35) 153.8,54.35 U1.11
SELECT_POL: length 419.6
  Top Layer w0.225: v1(114.79,56.66) 119.61,51.83 119.61,42.43 119.11,41.92 118.6,41.92 118.09,42.43 ; 151.11,42.43 152.38,42.43 v1(152.63,42.69)
  Top Layer w0.254: GPIO.13 95.5,2.45 v1(157.26,2.45)
  Inner2 w0.225: v1(63.73,50.05) 64.24,49.54 124.19,49.54 v1(126.22,51.58)
  Inner2 w0.254: v1(157.26,2.45) U1.37 ; v1(41.98,23.38) 64.33,45.73 64.33,49.54
  Bottom Layer w0.225: v1(114.79,56.66) 112.09,59.35 63.83,59.35 62.46,60.72 37.86,60.72 36.87,59.73 36.83,59.69 ; v1(152.63,42.69) 135.11,42.69 v1(126.22,51.58) ; v1(63.73,50.05) 59.17,50.05 49.53,59.69
  Bottom Layer w0.254: TEST-SCALER0.1 7.66,7.58 7.66,32.29 35.09,59.73 36.87,59.73 ; v1(41.98,23.38) 40.64,22.04 40.64,7.62 TEST-SCALER1.1
TADC0+: length 118.1
  Top Layer w0.254: v1(157.83,5.16) 157.58,4.9 131.16,4.9 TEST-TEENSY.4 128.08,7.98 102.51,7.98 88.14,22.35 74.17,22.35 J_AIN-TADC.7
  Inner2 w0.254: U1.35 175.32,17.59 170.78,17.59 169.88,16.7 169.88,15.93 159.1,5.16 v1(157.83,5.16)
TADC0-: length 105.7
  Inner1 w0.254: v1(121.16,10.16) 122.43,10.16 123.19,9.4 123.19,8.64 124.09,7.74 130.87,7.74 TEST-TEENSY.2 139.26,13.71 158.36,13.71 U1.41
  Bottom Layer w0.254: v1(121.16,10.16) 111.68,19.64 71.8,19.64 J_AIN-TADC.3
TADC1+: length 104.8
  Top Layer w0.254: v1(113.03,8.64) 98.81,22.86 76.2,22.86 J_AIN-TADC.8
  Inner1 w0.254: U1.40 159.63,12.44 139.52,12.44 132.33,5.26 125.73,5.26 TEST-TEENSY.8 123.25,7.74 113.93,7.74 v1(113.03,8.64)
TADC1-: length 113.9
  Top Layer w0.254: U1.42 158.62,4.88 158.24,4.49 129.03,4.49 TEST-TEENSY.6 125.81,5.33 104.39,5.33 87.9,21.83 72.92,21.83 71.12,23.62 71.12,24.64 70.36,25.4 68.58,25.4 J_AIN-TADC.4
TLEDS: length 161.1
  Top Layer w0.254: v1(147.84,8.13) 149.61,6.35 R2.1
  Inner1 w0.254: J_LED.1 23.17,63.5 23.17,61.72 61.27,23.62 v1(62.03,23.62)
  Bottom Layer w0.254: v1(147.84,8.13) 144.53,4.83 81.33,4.83 79.81,6.35 79.81,7.11 79.05,7.87 78.28,7.87 77.39,8.77 77.39,9.53 76.49,10.43 75.22,10.43 v1(62.03,23.62)
VOCM: length 9.3
  Top Layer w0.225: 115.09,43.93 115.09,44.93 109.22,50.8
VREF: length 146.1
  Top Layer w0.254: 14.61,26.44 14.85,26.68 14.85,27.04 15.52,27.71 ; 15.52,27.71 14,29.24 14,33.05 14.63,33.68 14.63,49.84 15.53,50.74 15.53,53.74 15.9,54.11 ; 15.52,27.71 15.75,27.94 15.88,27.94 ; v1(20.83,19.81) 20.83,23.11 16,27.94 15.88,27.94 ; 15.88,27.94 15.88,31.98
  Inner1 w0.254: 84.1,19 84.1,18.93 GPIO.16 ; 84.1,19 84.1,23.85 83.83,24.12 ; 84.1,19 72.73,7.62 55.88,7.62 TEST-SCALER1.12 53.34,7.62 22.86,7.62 TEST-SCALER0.12 21.59,19.05 v1(20.83,19.81) ; J_VREF.4 83.83,26.66 83.83,24.12 ; 83.83,24.12 J_VREF.3
VREF0: length 33.1
  Inner1 w0.254: J_VREF.1 76.2,29.21 76.2,53.34 ADC0.9
VREF1: length 21.2
  Top Layer w0.254: J_VREF.5 85.09,25.4 85.09,30.48 ADC1.9
$2N3272: length 80.9
  Inner2 w0.254: 36.83,24.13 63.5,50.8 106.68,50.8
$2N3817: length 7.9
  Top Layer w0.225: 115.09,43.43 114.05,43.43 109.22,48.26
$2N3823: length 7
  Top Layer w0.225: 109.22,45.72 112.01,42.93 115.09,42.93
$2N5156: length 9.3
  Top Layer w0.225: 142.24,50.8 148.11,44.93 148.11,43.93
$2N5160: length 101.3
  Inner2 w0.254: 139.7,50.8 127.13,38.23 115.7,38.23 115.57,38.35 63.75,38.35 49.53,24.13
$2N5161: length 7.9
  Top Layer w0.225: 148.11,43.43 147.07,43.43 142.24,48.26
$2N5162: length 7
  Top Layer w0.225: 148.11,42.93 145.03,42.93 142.24,45.72
$3N891: length 15.7
  Top Layer w0.254: 7.16,59.69 6.14,58.67 6.14,51.56 6.9,50.8 9.86,50.8 12.09,48.57
$3N1715: length 5.6
  Top Layer w0.254: 13.36,54.11 13.51,54.26 13.51,59.69
$3N3373: length 15.9
  Top Layer w0.254: 12.07,26.44 9.43,29.07 7.04,29.07 6.14,29.97 6.14,37.08 7.16,38.1
$3N3374: length 6.2
  Top Layer w0.254: 13.51,38.1 13.51,32.15 13.34,31.98
$4N5866: length 29.2
  Top Layer w0.254: R2.2 v1(157.98,8.64)
  Inner2 w0.254: U1.34 177.42,18.03 168.65,18.03 167.63,17.02 167.63,16.26 160.01,8.64 v1(157.98,8.64)

## Copper pours and planes (outline as drawn; the poured copper is in the pictures)
+5V on Top Layer: -8.89,92.71 219.71,92.71 219.71,-5.08 -8.89,-5.08
+5V on Inner2: -6.35,90.17 213.36,90.17 213.36,-5.08 -6.35,-5.08
GND on Bottom Layer: -3.81,88.9 214.63,88.9 214.63,-2.54 -3.81,-2.54
GND on Inner1: -8.89,91.44 214.63,91.44 214.63,-1.27 -8.89,-1.27

## Text on the board
Top Silkscreen Layer: V0.1 | T.F. Weihmann, 2024 | XenControl
